# Altium schematic sheet k10最小系统原理图.SchDoc
size A4
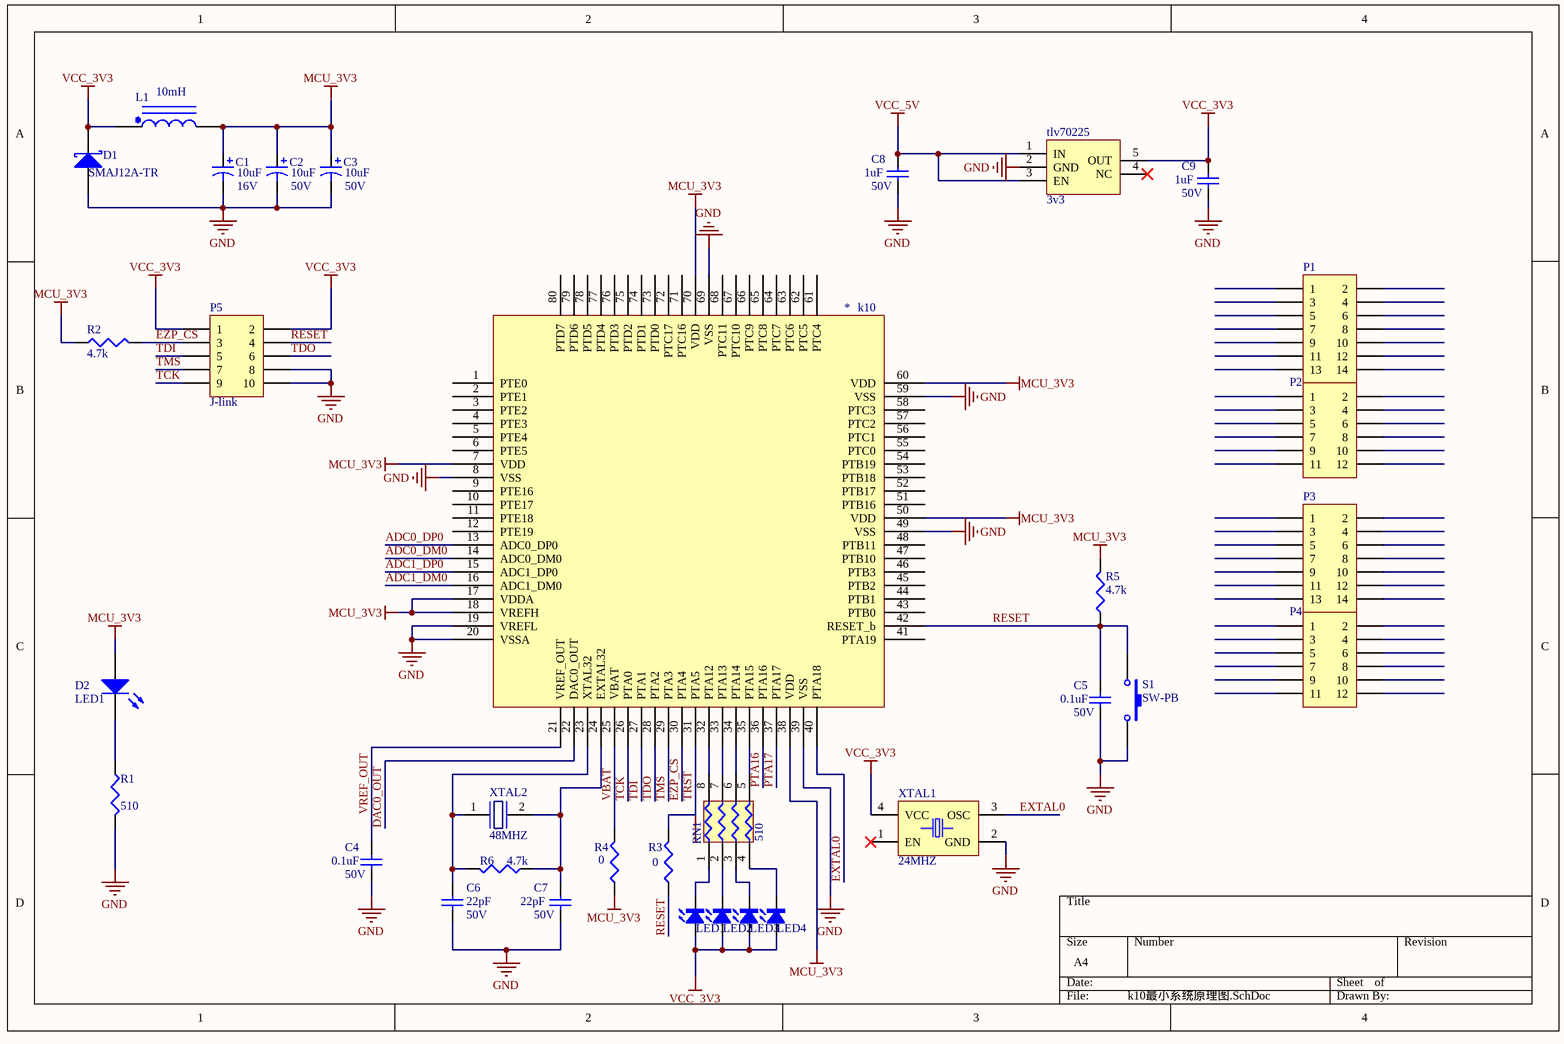
[diagram p0: k10最小系统原理图.SchDoc]

## Parts
*  k10  [k10 80pin]
C1  16V  value 10uF  [C0805]
C2  50V  value 10uF  [C0805]
C3  50V  value 10uF  [C0805]
C4  50V  value 0.1uF  [1608[0603]]
C5  50V  value 0.1uF  [1608[0603]]
C6  50V  value 22pF  [1608[0603]]
C7  50V  value 22pF  [1608[0603]]
C8  50V  value 1uF  [1608[0603]]
C9  50V  value 1uF  [1608[0603]]
D1  SMAJ12A-TR  [C1206]
D2  LED1  [6-0805]
L1  value 10mH  [C1206]  (hidden comment: Inductor Iron Dot)
LED1  LED  [0805LED1]  (value not drawn)
LED2  LED  [0805LED1]  (value not drawn)
LED3  LED  [0805LED1]  (value not drawn)
LED4  LED  [0805LED1]  (value not drawn)
P1  Header 7X2  [HDR2X7]  (value not drawn)
P2  Header 6X2  [HDR2X6]  (value not drawn)
P3  Header 7X2  [HDR2X7]  (value not drawn)
P4  Header 6X2  [HDR2X6]  (value not drawn)
P5  J-link  [HDR2X5]
R1  value 510  [J1-0603]  (hidden comment: Res3)
R2  value 4.7k  [J1-0603]  (hidden comment: Res3)
R3  value 0  [J1-0603]  (hidden comment: Res3)
R4  value 0  [J1-0603]  (hidden comment: Res3)
R5  value 4.7k  [J1-0603]  (hidden comment: Res3)
R6  value 4.7k  [J1-0603]  (hidden comment: Res3)
RN1  510  [res2*4]
S1  SW-PB  [SPST-2]
tlv70225  3v3  [tlv70225]
XTAL1  24MHZ  [XTAL-3225]
XTAL2  48MHZ  [XTAL1-KHz-直插3]

## Nets
GND: *.8(VSS) *.19(VREFL) *.20(VSSA) *.39(VSS) *.49(VSS) *.59(VSS) *.69(VSS) C1.2 C2.2 C3.2 C4.1 C5.1 C6.1 C7.1 C8.1 C9.1 D1.1(A) P5.8 P5.10 R1.2 S1.2 tlv70225.2(GND) XTAL1.2(GND)
MCU_3V3: *.7(VDD) *.17(VDDA) *.18(VREFH) *.38(VDD) *.50(VDD) *.60(VDD) *.70(VDD) C1.1 C2.1 C3.1 D2.1(A) L1.2 R2.1 R4.1 R5.2
VCC_3V3: C9.2 D1.2(K) L1.1 LED1.1(K) LED2.1(K) LED3.1(K) LED4.1(K) P5.1 P5.2 tlv70225.5(OUT) XTAL1.4(VCC)
VCC_5V: C8.2 tlv70225.1(IN) tlv70225.3(EN)
ADC0_DM0: *.14(ADC0_DM0)
ADC0_DP0: *.13(ADC0_DP0)
ADC1_DM0: *.16(ADC1_DM0)
ADC1_DP0: *.15(ADC1_DP0)
DAC0_OUT: *.22(DAC0_OUT)
EXTAL0: *.40(PTA18) XTAL1.3(OSC)
EZP_CS: *.30(PTA4) P5.3 R2.2
PTA16: *.36(PTA16)
PTA17: *.37(PTA17)
RESET: *.42(RESET_b) C5.2 P5.4 R3.1 R5.1 S1.1
TCK: *.26(PTA0) P5.9
TDI: *.27(PTA1) P5.5
TDO: *.28(PTA2) P5.6
TMS: *.29(PTA3) P5.7
TRST: *.31(PTA5) R3.2
VBAT: *.25(VBAT) R4.2
VREF_OUT: *.21(VREF_OUT) C4.2
Net*_23: *.23(XTAL32) C6.2 R6.2 XTAL2.1
Net*_24: *.24(EXTAL32) C7.2 R6.1 XTAL2.2
Net*_32: *.32(PTA12) RN1.8
Net*_33: *.33(PTA13) RN1.7
Net*_34: *.34(PTA14) RN1.6
Net*_35: *.35(PTA15) RN1.5
NetD2_2: D2.2(K) R1.1
NetLED1_2: LED1.2(A) RN1.1
NetLED2_2: LED2.2(A) RN1.2
NetLED3_2: LED3.2(A) RN1.3
NetLED4_2: LED4.2(A) RN1.4

Not connected (* = marked no-connect by the designer): * 1(PTE0) 2(PTE1) 3(PTE2) 4(PTE3) 5(PTE4) 6(PTE5) 9(PTE16) 10(PTE17) 11(PTE18) 12(PTE19) 41(PTA19) 43(PTB0) 44(PTB1) 45(PTB2) 46(PTB3) 47(PTB10) 48(PTB11) 51(PTB16) 52(PTB17) 53(PTB18) 54(PTB19) 55(PTC0) 56(PTC1) 57(PTC2) 58(PTC3) 61(PTC4) 62(PTC5) 63(PTC6) 64(PTC7) 65(PTC8) 66(PTC9) 67(PTC10) 68(PTC11) 71(PTC16) 72(PTC17) 73(PTD0) 74(PTD1) 75(PTD2) 76(PTD3) 77(PTD4) 78(PTD5) 79(PTD6) 80(PTD7); P1 1 2 3 4 5 6 7 8 9 10 11 12 13 14; P2 1 2 3 4 5 6 7 8 9 10 11 12; P3 1 2 3 4 5 6 7 8 9 10 11 12 13 14; P4 1 2 3 4 5 6 7 8 9 10 11 12; tlv70225 4(NC)*; XTAL1 1(EN)*

## Library data of the parts
* RN1 tlv70225 = Component_1
C1-C3 = Cap Pol3: Polarized Capacitor (Surface Mount); Published: 8-Jun-2000; LatestRevisionDate: 17-Jul-2002; LatestRevisionNote: Re-released for DXP Platform.; PackageReference: C0805; Publisher: Altium Limited
C4-C9 = Cap Semi: Capacitor (Semiconductor SIM Model); Published: 8-Jun-2000; LatestRevisionDate: 17-Jul-2002; LatestRevisionNote: Re-released for DXP Platform.; PackageReference: C1206; Publisher: Altium Limited
D1 = D Schottky: Schottky Diode; Published: 8-Jun-2000; LatestRevisionDate: 17-Jul-2002; LatestRevisionNote: Re-released for DXP Platform.; PackageReference: SMB; Publisher: Altium Limited; Code_JEDEC: DO-214-AA
D2 = LED2: Typical RED, GREEN, YELLOW, AMBER GaAs LED; Published: 8-Jun-2000; LatestRevisionDate: 17-Jul-2002; LatestRevisionNote: Re-released for DXP Platform.; PackageDocument: Feb-2002; PackageReference: 3.2X1.6X1.1; Publisher: Altium Limited
L1 = Inductor Iron Dot: Magnetic-Core Inductor with Winding Polarity Marking; Published: 24-Mar-1999; LatestRevisionDate: 17-Jul-2002; LatestRevisionNote: Re-released for DXP Platform.; PackageReference: DIODE_SMC; Publisher: Altium Limited
P1 P3 = Header 7X2: Header, 7-Pin, Dual row; LatestRevisionDate: 17-Jul-2002; LatestRevisionNote: Re-released for DXP Platform.; Publisher: Altium Limited
P2 P4 = Header 6X2: Header, 6-Pin, Dual row; LatestRevisionDate: 17-Jul-2002; LatestRevisionNote: Re-released for DXP Platform.; Publisher: Altium Limited
P5 = Header 5X2: Header, 5-Pin, Dual row; LatestRevisionDate: 17-Jul-2002; LatestRevisionNote: Re-released for DXP Platform.; Publisher: Altium Limited
R1-R6 = Res3: Resistor; Published: 8-Jun-2000; LatestRevisionDate: 04-Mar-2005; LatestRevisionNote: PCB Footprint replaced.; PackageReference: J1-0603; Publisher: Altium Limited
S1 = SW-PB: Switch; Published: 24-Mar-1999; LatestRevisionDate: 17-Jul-2002; LatestRevisionNote: Re-released for DXP Platform.; PackageReference: SPST-2; Publisher: Altium Limited
XTAL1 = XTAL
XTAL2 = XTAL-RTC